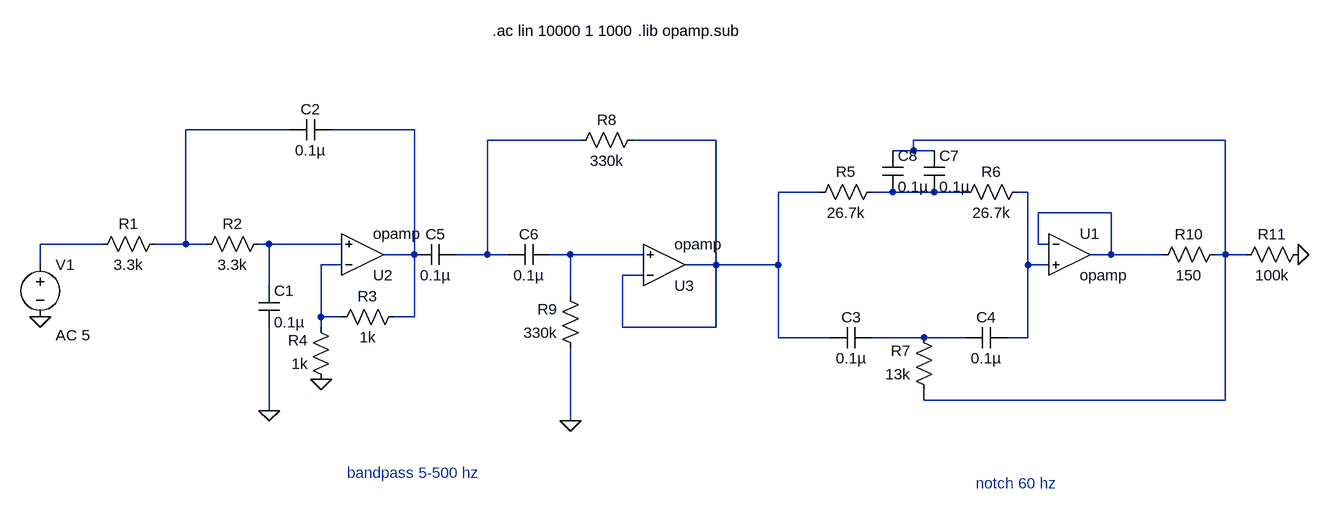
[diagram p0: schematic AllFiltersRev2.asc]
AllFiltersRev2.asc, the LTspice schematic file:
Version 4
SHEET 1 1828 820
WIRE -1008 128 -1168 128
WIRE -816 128 -944 128
WIRE -560 144 -704 144
WIRE -352 144 -480 144
WIRE 432 144 -48 144
WIRE -48 160 -48 144
WIRE -48 160 -80 160
WIRE -16 160 -48 160
WIRE -192 224 -256 224
WIRE -80 224 -112 224
WIRE -16 224 -80 224
WIRE 32 224 -16 224
WIRE 128 224 112 224
WIRE 256 256 144 256
WIRE -1296 304 -1392 304
WIRE -1168 304 -1168 128
WIRE -1168 304 -1216 304
WIRE -1136 304 -1168 304
WIRE -1040 304 -1056 304
WIRE -928 304 -1040 304
WIRE 144 304 144 256
WIRE 160 304 144 304
WIRE -816 320 -816 128
WIRE -816 320 -864 320
WIRE -704 320 -704 144
WIRE -704 320 -752 320
WIRE -672 320 -704 320
WIRE -576 320 -608 320
WIRE -464 320 -576 320
WIRE 256 320 256 256
WIRE 256 320 224 320
WIRE 336 320 256 320
WIRE 432 320 432 144
WIRE 432 320 416 320
WIRE 464 320 432 320
WIRE -1392 336 -1392 304
WIRE -928 336 -960 336
WIRE -352 336 -352 144
WIRE -352 336 -400 336
WIRE -256 336 -256 224
WIRE -256 336 -352 336
WIRE 128 336 128 224
WIRE 160 336 128 336
WIRE -464 352 -496 352
WIRE -1040 368 -1040 304
WIRE -576 384 -576 320
WIRE -960 416 -960 336
WIRE -928 416 -960 416
WIRE -816 416 -816 320
WIRE -816 416 -848 416
WIRE -960 432 -960 416
WIRE -496 432 -496 352
WIRE -352 432 -352 336
WIRE -352 432 -496 432
WIRE -256 448 -256 336
WIRE -176 448 -256 448
WIRE -32 448 -112 448
WIRE 32 448 -32 448
WIRE 128 448 128 336
WIRE 128 448 96 448
WIRE -32 544 -32 528
WIRE 432 544 432 320
WIRE 432 544 -32 544
WIRE -1040 560 -1040 432
WIRE -576 576 -576 464
FLAG -1040 560 0
FLAG -1392 416 0
FLAG -576 576 0
FLAG -960 512 0
FLAG 544 320 0
SYMBOL voltage -1392 320 R0
WINDOW 123 24 124 Left 2
WINDOW 39 0 0 Left 0
SYMATTR Value2 AC 5
SYMATTR InstName V1
SYMATTR Value ""
SYMBOL res -1200 288 R90
WINDOW 0 0 56 VBottom 2
WINDOW 3 32 56 VTop 2
SYMATTR InstName R1
SYMATTR Value 3.3k
SYMBOL res -1040 288 R90
WINDOW 0 0 56 VBottom 2
WINDOW 3 32 56 VTop 2
SYMATTR InstName R2
SYMATTR Value 3.3k
SYMBOL cap -1056 368 R0
SYMATTR InstName C1
SYMATTR Value 0.1µ
SYMBOL cap -944 112 R90
WINDOW 0 0 32 VBottom 2
WINDOW 3 32 32 VTop 2
SYMATTR InstName C2
SYMATTR Value 0.1µ
SYMBOL OpAmps\\opamp -896 384 M180
SYMATTR InstName U2
SYMBOL cap -752 304 R90
WINDOW 0 0 32 VBottom 2
WINDOW 3 32 32 VTop 2
SYMATTR InstName C5
SYMATTR Value 0.1µ
SYMBOL cap -608 304 R90
WINDOW 0 0 32 VBottom 2
WINDOW 3 32 32 VTop 2
SYMATTR InstName C6
SYMATTR Value 0.1µ
SYMBOL res -464 128 R90
WINDOW 0 0 56 VBottom 2
WINDOW 3 32 56 VTop 2
SYMATTR InstName R8
SYMATTR Value 330k
SYMBOL res -560 480 R180
WINDOW 0 36 76 Left 2
WINDOW 3 36 40 Left 2
SYMATTR InstName R9
SYMATTR Value 330k
SYMBOL OpAmps\\opamp -432 400 M180
SYMATTR InstName U3
SYMBOL res -832 400 R90
WINDOW 0 0 56 VBottom 2
WINDOW 3 32 56 VTop 2
SYMATTR InstName R3
SYMATTR Value 1k
SYMBOL res -944 528 R180
WINDOW 0 36 76 Left 2
WINDOW 3 36 40 Left 2
SYMATTR InstName R4
SYMATTR Value 1k
SYMBOL res -96 208 R90
WINDOW 0 0 56 VBottom 2
WINDOW 3 32 56 VTop 2
SYMATTR InstName R5
SYMATTR Value 26.7k
SYMBOL res 128 208 R90
WINDOW 0 0 56 VBottom 2
WINDOW 3 32 56 VTop 2
SYMATTR InstName R6
SYMATTR Value 26.7k
SYMBOL res -16 544 R180
WINDOW 0 36 76 Left 2
WINDOW 3 36 40 Left 2
SYMATTR InstName R7
SYMATTR Value 13k
SYMBOL cap -112 432 R90
WINDOW 0 0 32 VBottom 2
WINDOW 3 32 32 VTop 2
SYMATTR InstName C3
SYMATTR Value 0.1µ
SYMBOL cap 96 432 R90
WINDOW 0 0 32 VBottom 2
WINDOW 3 32 32 VTop 2
SYMATTR InstName C4
SYMATTR Value 0.1µ
SYMBOL OpAmps\\opamp 192 256 R0
SYMATTR InstName U1
SYMBOL res 432 304 R90
WINDOW 0 0 56 VBottom 2
WINDOW 3 32 56 VTop 2
SYMATTR InstName R10
SYMATTR Value 150
SYMBOL res 560 304 R90
WINDOW 0 0 56 VBottom 2
WINDOW 3 32 56 VTop 2
SYMATTR InstName R11
SYMATTR Value 100k
SYMBOL cap -32 160 R0
SYMATTR InstName C7
SYMATTR Value 0.1µ
SYMBOL cap -96 160 R0
SYMATTR InstName C8
SYMATTR Value 0.1µ
TEXT -696 -24 Left 2 !.ac lin 10000 1 1000
TEXT -920 656 Left 2 ;bandpass 5-500 hz
TEXT -472 -24 Left 2 !.lib opamp.sub
TEXT 48 672 Left 2 ;notch 60 hz

The netlist it stands for:
* AllFiltersRev2.asc
V1 N009 0 AC 5
R1 N001 N009 3.3k
R2 N010 N001 3.3k
C1 N010 0 0.1µ
C2 N002 N001 0.1µ
XU2 N012 N010 N002 opamp Aol=100K GBW=10Meg  ; pins invin noninvin out
C5 N003 N002 0.1µ
C6 N011 N003 0.1µ
R8 N004 N003 330k
R9 0 N011 330k
XU3 N004 N011 N004 opamp Aol=100K GBW=10Meg  ; pins invin noninvin out
R3 N002 N012 1k
R4 0 N012 1k
R5 N006 N004 26.7k
R6 N007 N006 26.7k
R7 N005 N013 13k
C3 N013 N004 0.1µ
C4 N007 N013 0.1µ
XU1 N008 N007 N008 opamp Aol=100K GBW=10Meg  ; pins invin noninvin out
R10 N005 N008 150
R11 0 N005 100k
C7 N005 N006 0.1µ
C8 N005 N006 0.1µ
.ac lin 10000 1 1000
* bandpass 5-500 hz
.lib opamp.sub
* notch 60 hz
.backanno
.end